# Altium schematic sheet Principal.SchDoc
size Letter; ApprovedBy: M. en C. Fernando Bolaños; CheckedBy: M. en C. José Alberto Balderas Castillo (CID); Author: M. en C. José Alberto Balderas Castillo (CID); Revision: v1; NombreTarjeta: TELCOMGPRS-v1; NumeroDeHoja: 1 de 7; NombreBloque: Diagrama a Bloques; FechaDiseno: 02-Junio-2015; FechaRevision: 05-Junio-2015; FechaAprobacion: 16-Junio-2015; TamanoHoja: Carta; NombreProyecto: Telemetria GPRS de Bajo Consumo de Energia
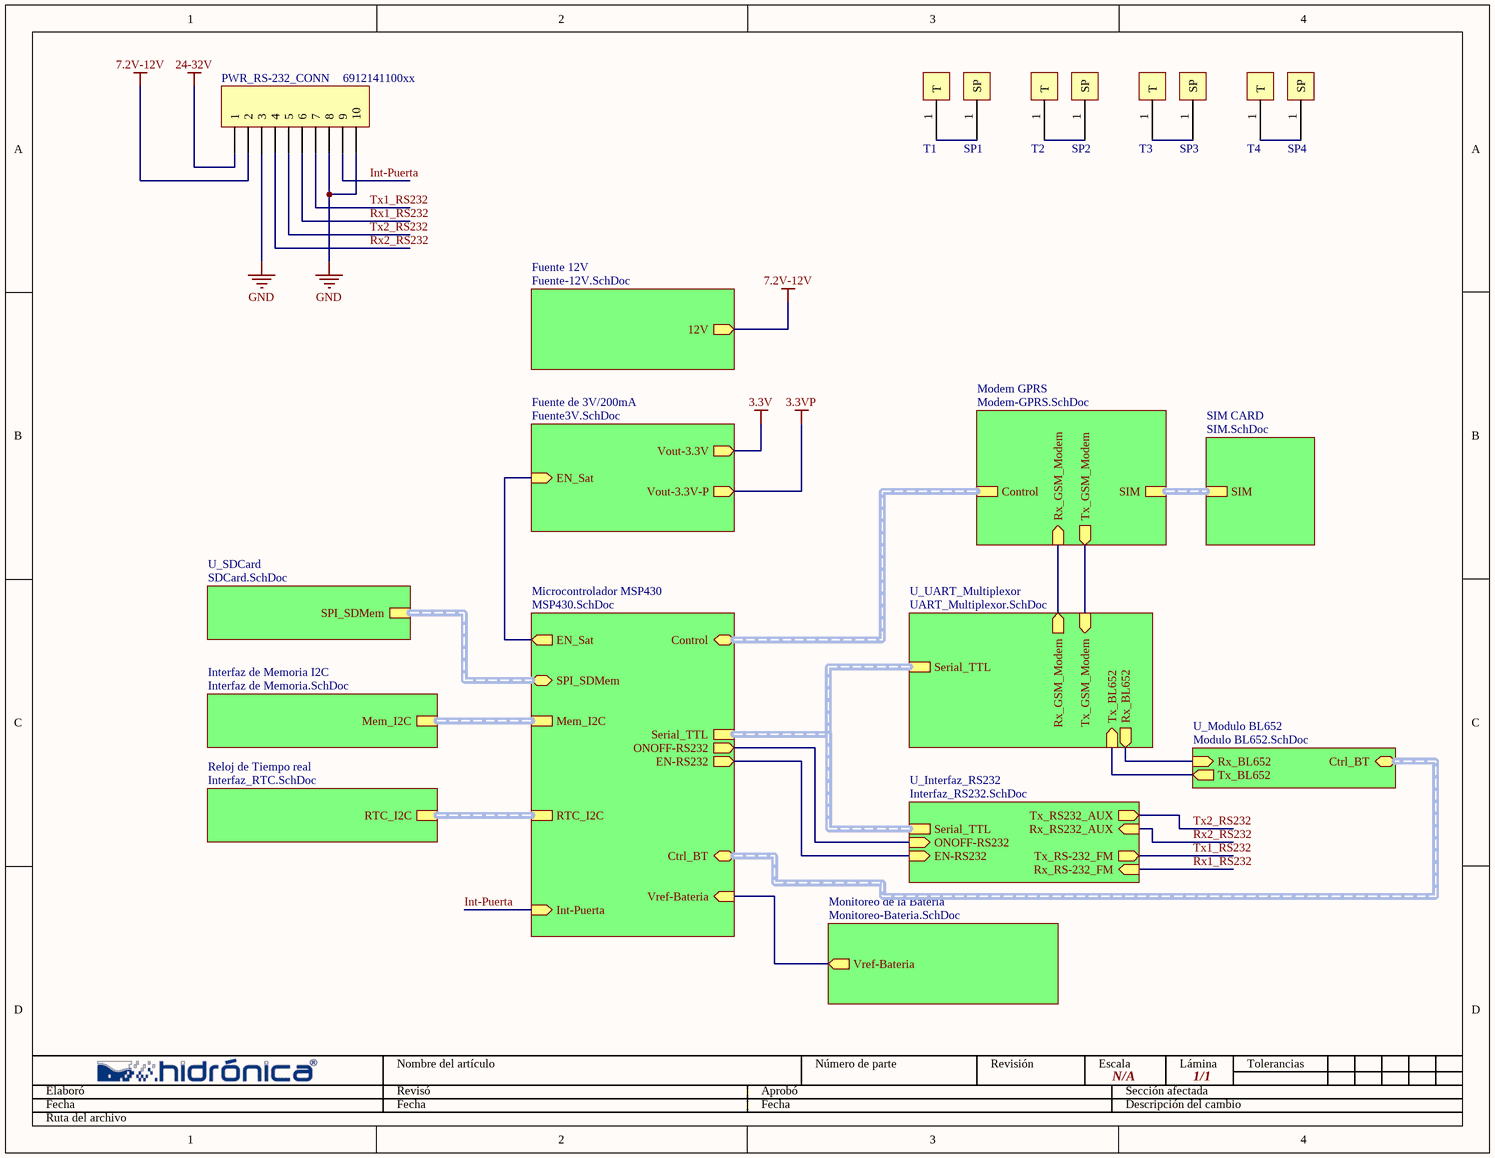
[diagram p0: Principal.SchDoc]

## Parts
PWR_RS-232_CONN  6912141100xx  [691214110002x2_691214110003x2]
SP1  (no value)  [SPACER]
SP2  (no value)  [SPACER]
SP3  (no value)  [SPACER]
SP4  (no value)  [SPACER]
T1  (no value)  [Tornillo]
T2  (no value)  [Tornillo]
T3  (no value)  [Tornillo]
T4  (no value)  [Tornillo]

## Sub-sheets
Fuente 12V = Fuente-12V.SchDoc: 12V (out)
Fuente de 3V/200mA = Fuente3V.SchDoc: Vout-3.3V (out), Vout-3.3V-P (out), EN_Sat (in)
Interfaz de Memoria I2C = Interfaz de Memoria.SchDoc: Mem_I2C (harness Memorias I2C)
Microcontrolador MSP430 = MSP430.SchDoc: Mem_I2C (harness Memorias I2C), RTC_I2C (harness Reloj RTC), Serial_TTL (harness Puertos Seriales), Vref-Bateria (in), Int-Puerta (in), ONOFF-RS232 (out), EN-RS232 (out), EN_Sat (out), Control (harness Control), SPI_SDMem (harness SPI1), Ctrl_BT (harness Bluetooth_Ctrl)
Modem GPRS = Modem-GPRS.SchDoc: SIM (harness SIM), Control (harness Control), Rx_GSM_Modem (in), Tx_GSM_Modem (out)
Monitoreo de la Bateria = Monitoreo-Bateria.SchDoc: Vref-Bateria (out)
Reloj de Tiempo real = Interfaz_RTC.SchDoc: RTC_I2C (harness Reloj RTC)
SIM CARD = SIM.SchDoc: SIM (harness SIM)
U_Interfaz_RS232 = Interfaz_RS232.SchDoc: Serial_TTL (harness Puertos Seriales), Rx_RS-232_FM (in), Tx_RS-232_FM (out), ONOFF-RS232 (in), EN-RS232 (in), Tx_RS232_AUX (out), Rx_RS232_AUX (in)
U_Modulo BL652 = Modulo BL652.SchDoc: Rx_BL652 (in), Tx_BL652 (out), Ctrl_BT (harness Bluetooth_Ctrl)
U_SDCard = SDCard.SchDoc: SPI_SDMem (harness SPI1)
U_UART_Multiplexor = UART_Multiplexor.SchDoc: Rx_GSM_Modem (out), Rx_BL652 (out), Tx_GSM_Modem (in), Tx_BL652 (in), Serial_TTL (harness Puertos Seriales)

## Nets
3.3V: sheet Fuente de 3V/200mA/Vout-3.3V
3.3VP: sheet Fuente de 3V/200mA/Vout-3.3V-P
7.2V-12V: PWR_RS-232_CONN.2 ; sheet Fuente 12V/12V
24-32V: PWR_RS-232_CONN.1
GND: PWR_RS-232_CONN.3 PWR_RS-232_CONN.8 PWR_RS-232_CONN.10
Int-Puerta: PWR_RS-232_CONN.9 ; sheet Microcontrolador MSP430/Int-Puerta
Rx1_RS232: PWR_RS-232_CONN.6 ; sheet U_Interfaz_RS232/Rx_RS-232_FM
Rx2_RS232: PWR_RS-232_CONN.4 ; sheet U_Interfaz_RS232/Rx_RS232_AUX
Tx1_RS232: PWR_RS-232_CONN.7 ; sheet U_Interfaz_RS232/Tx_RS-232_FM
Tx2_RS232: PWR_RS-232_CONN.5 ; sheet U_Interfaz_RS232/Tx_RS232_AUX
NetSP1_1: SP1.1(SP) T1.1(T)
NetSP2_1: SP2.1(SP) T2.1(T)
NetSP3_1: SP3.1(SP) T3.1(T)
NetSP4_1: SP4.1(SP) T4.1(T)
(unnamed): sheet Fuente de 3V/200mA/EN_Sat, sheet Microcontrolador MSP430/EN_Sat
(unnamed): sheet Monitoreo de la Bateria/Vref-Bateria, sheet Microcontrolador MSP430/Vref-Bateria
(unnamed): sheet Microcontrolador MSP430/ONOFF-RS232, sheet U_Interfaz_RS232/ONOFF-RS232
(unnamed): sheet Microcontrolador MSP430/EN-RS232, sheet U_Interfaz_RS232/EN-RS232
(unnamed): sheet Modem GPRS/Rx_GSM_Modem, sheet U_UART_Multiplexor/Rx_GSM_Modem
(unnamed): sheet Modem GPRS/Tx_GSM_Modem, sheet U_UART_Multiplexor/Tx_GSM_Modem
(unnamed): sheet U_UART_Multiplexor/Rx_BL652, sheet U_Modulo BL652/Rx_BL652
(unnamed): sheet U_UART_Multiplexor/Tx_BL652, sheet U_Modulo BL652/Tx_BL652

## Buses and harness runs
harness sheet Interfaz de Memoria I2C/Mem_I2C = sheet Microcontrolador MSP430/Mem_I2C
harness sheet Microcontrolador MSP430/Control = sheet Modem GPRS/Control
harness sheet Microcontrolador MSP430/Ctrl_BT = sheet U_Modulo BL652/Ctrl_BT
harness sheet Microcontrolador MSP430/RTC_I2C = sheet Reloj de Tiempo real/RTC_I2C
harness sheet Microcontrolador MSP430/Serial_TTL = sheet U_Interfaz_RS232/Serial_TTL = sheet U_UART_Multiplexor/Serial_TTL
harness sheet Microcontrolador MSP430/SPI_SDMem = sheet U_SDCard/SPI_SDMem
harness sheet Modem GPRS/SIM = sheet SIM CARD/SIM

## Notes on the sheet
- Elaboró
- Fecha
- Nombre del artículo
- Revisó
- Aprobó
- Número de parte
- Revisión
- Escala
- N/A
- Sección afectada
- Descripción del cambio
- Lámina
- 1/1
- Tolerancias
- Ruta del archivo

## Library data of the parts
PWR_RS-232_CONN = Header 10H: 10 Position Wire to Board Terminal Block Horizontal with Board 0.200" (5.08mm) Through Hole; Manufacturer: Wurth Elektronik; Number of Levels: 1; Positions Per Level: 10; Pitch: 3.5 mm; Current: 15A; Voltage: 300V; Wire Gauge: 14-30 AWG; Wire Termination: Screw - Rising Cage Clamp; Torque - Screw: 0.5-0.6 Nm (4.4-5.3 Lb-In); Screw Thread: M3; LatestRevisionDate: 17-Jul-2002; LatestRevisionNote: Re-released for DXP Platform.; Publisher: Altium Limited; Numero de Parte: 6912141100xx; Supplier 1: Wurth Elektronik; Supplier Part Number 1: 6912141100xx; Manufacturer Part Number: 6912141100xx; RoHS: RoHS Compliant; Category: Connectors, Interconnects; Stock 1: 453; Pricing 1: 1=5.34, 10=5.189, 50=4.85, 100=4.462, 250=4.12248, 500=3.9285, 1000=3.686 (USD); Packaging: Bulk; Part Status: Active; Mating Orientation: Horizontal with Board; Mounting Type: Through Hole; Features: Interlocking (Side); Color: Green; Operating Temperature: -; Housing Material: Polyamide (PA), Nylon; Contact Material - Plating: -; Clamp Material - Plating: -; Screw Material - Plating: -; ComponentLink1URL: http://media.digikey.com/pdf/Data%20Sheets/Phoenix%20Contact%20PDFs/1715802.pdf; ComponentLink1Description: http://media.digikey.com/pdf/Data%20Sheets/Phoenix%20Contact%20PDFs/1715802.pdf
SP1-SP4 T1-T4 = PRUEBA: No Aplica; Numero de Parte: No Aplica